# EAGLE schematic Rangakaian OP-AMP Theo (EAGLE 9.6.2)
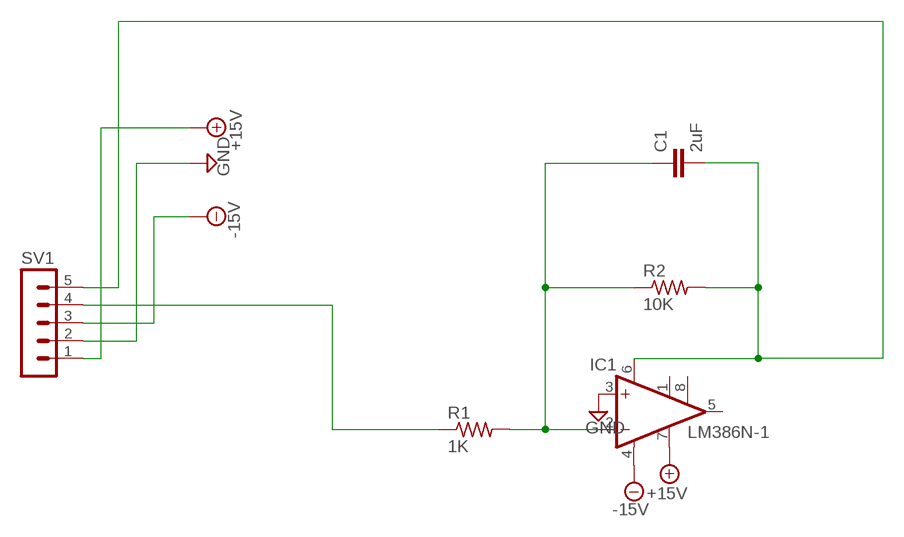
[diagram p0: schematic, sheet 1]

## Parts
C1  2uF  C-EU025-024X044  [C025-024X044]
IC1  LM386N-1  [DIL08]
R1  1K  R-US_0204/5  [0204/5]
R2  10K  R-US_0204/5  [0204/5]
SV1  MA05-1  [MA05-1]

## Nets
+15V: IC1.7(BYPASS) SV1.1
-15V: IC1.4(GND) SV1.3
GND: IC1.3(+IN) SV1.2
N$1: C1.1 IC1.2(-IN) R1.2 R2.1
N$2: C1.2 IC1.6(VS) R2.2 SV1.5
N$4: R1.1 SV1.4
Unconnected: IC1.1(GAIN) IC1.5(OUT) IC1.8(GAIN)

## Library data of the parts
C1 = rcl:C-EU: CAPACITOR, European symbol; SPICEPREFIX: C
IC1 = linear:LM386?-*: Low Voltage Audio Power Amplifier Source: http://cache.national.com/ds/LM/LM386.pdf
R1 R2 = rcl:R-US_: RESISTOR, American symbol; SPICEPREFIX: R
SV1 = con-lstb:MA05-1: PIN HEADER; OC_FARNELL: unknown; OC_NEWARK: unknown